# Altium schematic sheet Proyecto_DYCDE2021.SchDoc
size A4; SheetNumber: 1; SheetTotal: 3
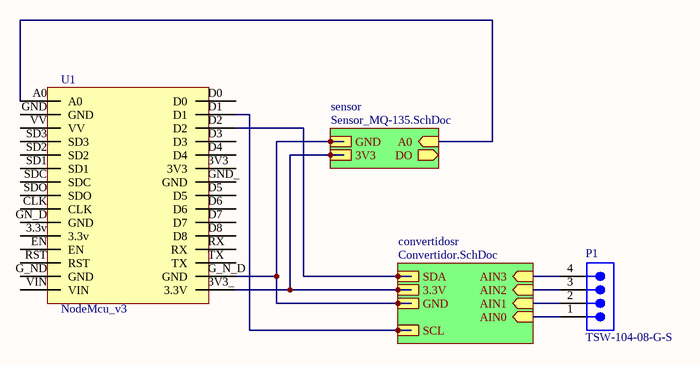
[diagram p0: Proyecto_DYCDE2021.SchDoc]

## Parts
P1  TSW-104-08-G-S  [SMTC-TSW-104-08-X-S]
U1  NodeMcu_v3  [NodeMcu_v3]

## Sub-sheets
convertidosr = Convertidor.SchDoc: SDA, 3.3V, GND, SCL, AIN3 (in), AIN2 (in), AIN1 (in), AIN0 (in)
sensor = Sensor_MQ-135.SchDoc: GND, 3V3, A0 (in), DO (out)

## Nets
NetP1_1: P1.1 ; sheet convertidosr/AIN0
NetP1_2: P1.2 ; sheet convertidosr/AIN1
NetP1_3: P1.3 ; sheet convertidosr/AIN2
NetP1_4: P1.4 ; sheet convertidosr/AIN3
NetU1_3V3_: U1.3V3_(3.3V) ; sheet sensor/3V3, sheet convertidosr/3.3V
NetU1_A0: U1.A0 ; sheet sensor/A0
NetU1_D1: U1.D1 ; sheet convertidosr/SCL
NetU1_D2: U1.D2 ; sheet convertidosr/SDA
NetU1_G_N_D: U1.G_N_D(GND) ; sheet sensor/GND, sheet convertidosr/GND

Not connected (* = marked no-connect by the designer): U1 3.3v 3V3 CLK D0 D3 D4 D5 D6 D7 D8 EN G_ND(GND) GN_D(GND) GND GND_(GND) RST RX SD1 SD2 SD3 SDC SDO TX VIN VV

## Library data of the parts
P1 = CMP-1024-00357-1: 0.025" SQ Post Header, Through-hole, Vertical, -55 to 125 degC, 2.54 mm Pitch, 4-Pin, Male, RoHS; Manufacturer: Samtec; Pitch: 2.54 mm; RoHS: True; ComponentLink3URL: http://www.samtec.com/documents/webfiles/cpdf/TSW-XXX-XX-XXX-X-XX-XXX-MKT.pdf; Mounting Technology: Through-hole; ComponentLink2URL: http://www.samtec.com/documents/webfiles/pdf/TSW_TH.PDF; ComponentLink1URL: http://www.samtec.com; ComponentLink3Description: Package Specification; PackageVersion: DM, 8/1988; ComponentLink2Description: Datasheet; PackageReference: TSW-104-08-X-S; PackageDescription: .025[0.64] SQ. Post Terminal Strip Assembly; PartNumber: TSW-104-08-G-S; ComponentLink1Description: Manufacturer URL; Temperature Range: -55 to 125 degC; DatasheetVersion: F-214; Orientation: Vertical